# Altium schematic sheet Schematic.SchDoc
size A; SheetNumber: 1; SheetTotal: 1
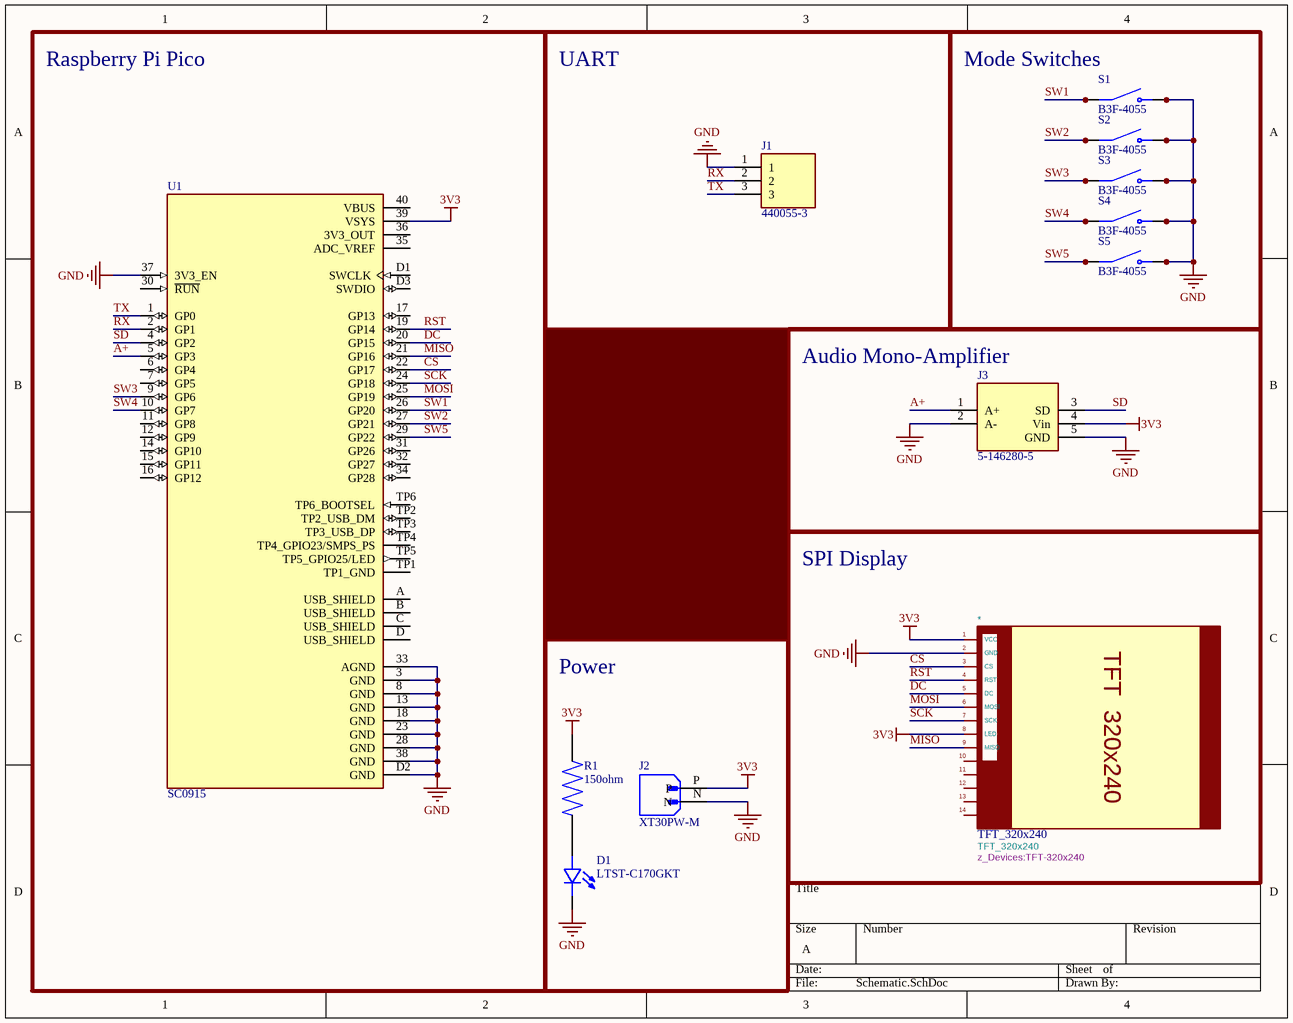
[diagram p0: Schematic.SchDoc]

## Parts
*  TFT_320x240  Footprint: z_Devices:TFT-320x240  [TFT-320x240]
D1  LTST-C170GKT  [LED_LTST-C170GKT]
J1  440055-3  [TE_440055-3]
J2  XT30PW-M  [AMASS_XT30PW-M]
J3  5-146280-5  [TE_5-146280-5]
R1  150ohm  [RESC1005X40N]
S1  B3F-4055  [SW_B3F-4055]
S2  B3F-4055  [SW_B3F-4055]
S3  B3F-4055  [SW_B3F-4055]
S4  B3F-4055  [SW_B3F-4055]
S5  B3F-4055  [SW_B3F-4055]
U1  SC0915  [MODULE_SC0915]

## Blocks framed on the sheet
Raspberry Pi Pico: U1
UART: J1
Mode Switches: S1-S5
Audio Mono-Amplifier: J3
SPI Display: *
Power: D1 J2 R1

## Nets
3V3: *.1(VCC) *.8(LED) J2.P J3.4(Vin) R1.1 U1.39(VSYS)
GND: *.2(GND) D1.1(C) J1.1 J2.N J3.2(A-) J3.5(GND) S1.3(NO) S1.4(NO) S2.3(NO) S2.4(NO) S3.3(NO) S3.4(NO) S4.3(NO) S4.4(NO) S5.3(NO) S5.4(NO) U1.3(GND) U1.8(GND) U1.13(GND) U1.18(GND) U1.23(GND) U1.28(GND) U1.33(AGND) U1.37(3V3_EN) U1.38(GND) U1.D2(GND)
A+: J3.1(A+) U1.5(GP3)
CS: *.3(CS) U1.22(GP17)
DC: *.5(DC) U1.20(GP15)
MISO: *.9(MISO) U1.21(GP16)
MOSI: *.6(MOSI) U1.25(GP19)
RST: *.4(RST) U1.19(GP14)
RX: J1.2 U1.2(GP1)
SCK: *.7(SCK) U1.24(GP18)
SD: J3.3(SD) U1.4(GP2)
SW1: S1.1(COM) S1.2(COM) U1.26(GP20)
SW2: S2.1(COM) S2.2(COM) U1.27(GP21)
SW3: S3.1(COM) S3.2(COM) U1.9(GP6)
SW4: S4.1(COM) S4.2(COM) U1.10(GP7)
SW5: S5.1(COM) S5.2(COM) U1.29(GP22)
TX: J1.3 U1.1(GP0)
NetD1_2: D1.2(A) R1.2

Not connected (* = marked no-connect by the designer): * 10 11 12 13 14; U1 6(GP4) 7(GP5) 11(GP8) 12(GP9) 14(GP10) 15(GP11) 16(GP12) 17(GP13) 30(~{RUN}) 31(GP26) 32(GP27) 34(GP28) 35(ADC_VREF) 36(3V3_OUT) 40(VBUS) A(USB_SHIELD) B(USB_SHIELD) C(USB_SHIELD) D(USB_SHIELD) D1(SWCLK) D3(SWDIO) TP1(TP1_GND) TP2(TP2_USB_DM) TP3(TP3_USB_DP) TP4(TP4_GPIO23/SMPS_PS) TP5(TP5_GPIO25/LED) TP6(TP6_BOOTSEL)

## Notes on the sheet
- (in symbol TFT_320x240) TFT  320x240

## Library data of the parts
D1 = LTST-C170GKT: Green 569nm LED Indication - Discrete 2.1V 0805 (2012 Metric); MF: Lite-On Inc.; SnapEDA_Link: https://www.snapeda.com/parts/LTST-C170GKT/Lite-On/view-part/?ref=snap; Package: 0805 Lite-On Inc.; Value: *; MP: LTST-C170GKT; Check_prices: https://www.snapeda.com/parts/LTST-C170GKT/Lite-On/view-part/?ref=eda
J1 = 440055-3: Connector Header Through Hole, Right Angle 3 position 0.079 _2.00mm_; MF: TE Connectivity; Value: *; Digi-Key_Part_Number: A100044-ND; SnapEDA_Link: https://www.snapeda.com/parts/440055-3/TE%20Connectivity%20AMP%20Connectors/view-part/2374828/?ref=snap; Package: None; MP: 440055-3; EU_RoHS_Compliance: Compliant; DigiKey-Purchase-URL: https://snapeda.com/shop?store=DigiKey&id=2374828
J2 = XT30PW-M: Socket; DC supply; XT30; male; PIN: 2; on PCBs; THT; Colour: yellow; MF: AMASS; SnapEDA_Link: https://www.snapeda.com/parts/XT30PW-M/AMASS/view-part/?ref=snap; Package: None; Value: *; MP: XT30PW-M; Check_prices: https://www.snapeda.com/parts/XT30PW-M/AMASS/view-part/?ref=eda
J3 = 5-146280-5: 05 MODII HDR SRST B/A .100CL; Package: None; Value: *; Price: None; MP: 5-146280-5; Availability: Unavailable
R1 = RC0402FR-07150RL: 150 Ohms Â±1% 0.063W, 1/16W Chip Resistor 0402 (1005 Metric) Moisture Resistant Thick Film; MF: Yageo; SnapEDA_Link: https://www.snapeda.com/parts/RC0402FR-07150RL/Yageo/view-part/?ref=snap; Package: 1005 Panasonic Electronic Components; Value: *; MP: RC0402FR-07150RL; Check_prices: https://www.snapeda.com/parts/RC0402FR-07150RL/Yageo/view-part/?ref=eda
U1 = SC0915: RP2040 Raspberry Pi Pico series ARMÂ® CortexÂ®-M0+ MCU 32-Bit Embedded Evaluation Board; SnapEDA_Link: https://www.snapeda.com/parts/SC0915/Raspberry+Pi/view-part/?ref=snap; Availability: In Stock; Package: None; Price: None; MP: SC0915; Check_prices: https://www.snapeda.com/parts/SC0915/Raspberry+Pi/view-part/?ref=eda; MF: Raspberry Pi; Value: *; Purchase-URL: https://pricing.snapeda.com/search/part/SC0915/?ref=eda
* = TFT_320x240: Value: TFT_320x240
S1-S5 = B3F-4055: Price: None; MP: B3F-4055; Availability: Unavailable; Value: *; Package: None